# Altium schematic sheet Indicator_LEDs_RGB.SchDoc
size A4
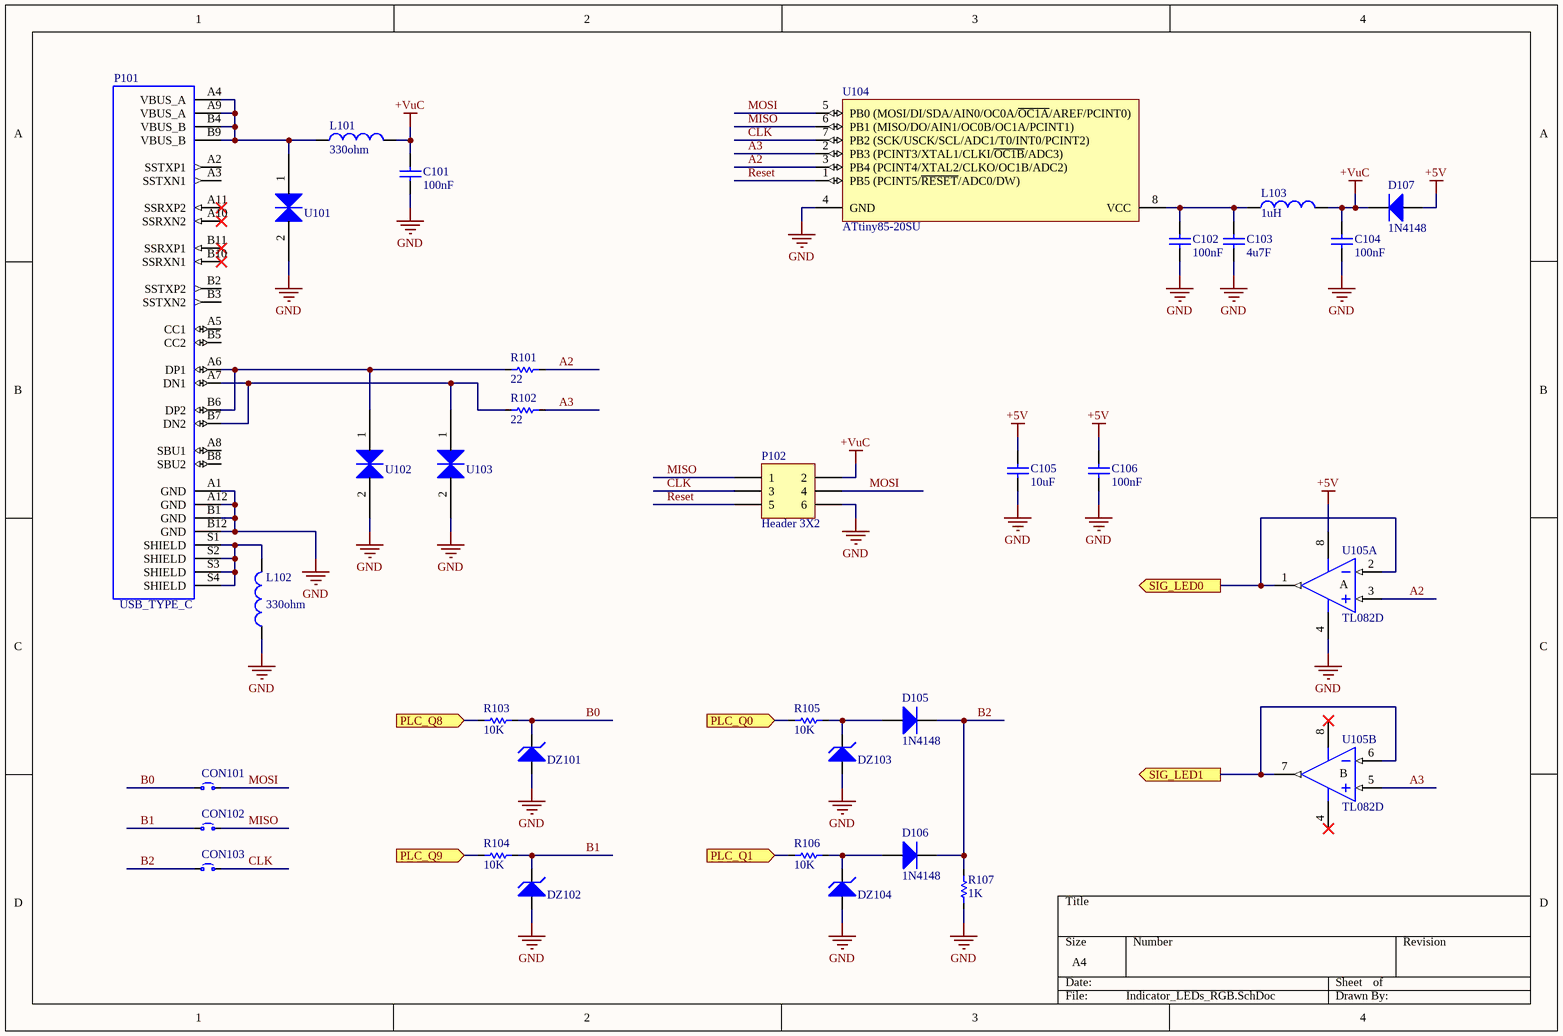
[diagram p0: Indicator_LEDs_RGB.SchDoc]

## Parts
C101  VALOR: 100nF  [C0603]  (hidden comment: Cap Ceramico SMD)
C102  VALOR: 100nF  [C0603]  (hidden comment: Cap Ceramico SMD)
C103  VALOR: 4u7F  [C0603]  (hidden comment: Cap Ceramico SMD)
C104  VALOR: 100nF  [C0603]  (hidden comment: Cap Ceramico SMD)
C105  VALOR: 10uF  [C0603]  (hidden comment: Cap Ceramico SMD)
C106  VALOR: 100nF  [C0603]  (hidden comment: Cap Ceramico SMD)
CON101  Puente  [PUENTE 0805]  (value not drawn)
CON102  Puente  [PUENTE 0805]  (value not drawn)
CON103  Puente  [PUENTE 0805]  (value not drawn)
D105  VALOR: 1N4148  [SOD-80]  (hidden comment: Diodo Rectificador SMD)
D106  VALOR: 1N4148  [SOD-80]  (hidden comment: Diodo Rectificador SMD)
D107  VALOR: 1N4148  [SOD-80]  (hidden comment: Diodo Rectificador SMD)
DZ101  Diodo Zenner SMD  [SOD-80]  (value not drawn)
DZ102  Diodo Zenner SMD  [SOD-80]  (value not drawn)
DZ103  Diodo Zenner SMD  [SOD-80]  (value not drawn)
DZ104  Diodo Zenner SMD  [SOD-80]  (value not drawn)
L101  value 330ohm  [J1-0603]  (hidden comment: Inductor)
L102  value 330ohm  [J1-0603]  (hidden comment: Inductor)
L103  value 1uH  [INDC1608L]  (hidden comment: Inductor)
P101  USB_TYPE_C  [USB_TYPE_C]
P102  Header 3X2  [HDR2X3]
R101  VALOR: 22  [R0603]  (hidden comment: Res SMD)
R102  VALOR: 22  [R0603]  (hidden comment: Res SMD)
R103  VALOR: 10K  [R0603]  (hidden comment: Res SMD)
R104  VALOR: 10K  [R0603]  (hidden comment: Res SMD)
R105  VALOR: 10K  [R0603]  (hidden comment: Res SMD)
R106  VALOR: 10K  [R0603]  (hidden comment: Res SMD)
R107  VALOR: 1K  [R0603]  (hidden comment: Res SMD)
U101  DIODE TVS BIDIR  [J1-0603]  (value not drawn)
U102  DIODE TVS BIDIR  [J1-0603]  (value not drawn)
U103  DIODE TVS BIDIR  [J1-0603]  (value not drawn)
U104  ATtiny85-20SU  [8S2_M]
U105  TL082D  [D008_L]  (parts A,B of 2)

## Ports
PLC_Q0 (in), PLC_Q1 (in), PLC_Q8 (in), PLC_Q9 (in), SIG_LED0 (out), SIG_LED1 (out)

## Nets
+5V: C105.1 C106.1 D107.1(A) U105.8(V+)
+VuC: C101.1 C104.1 D107.2(K) L101.2 L103.2 P102.2
GND: C101.2 C102.2 C103.1 C104.2 C105.2 C106.2 DZ101.1(A) DZ102.1(A) DZ103.1(A) DZ104.1(A) L102.1 P101.A1(GND) P101.A12(GND) P101.B1(GND) P101.B12(GND) P102.6 R107.2 U101.2 U102.2 U103.2 U104.4(GND) U105.4(V-)
A2: R101.1 U104.3(PB4_(PCINT4/XTAL2/CLKO/OC1B/ADC2)) U105.3(IN+)
A3: R102.1 U104.2(PB3_(PCINT3/XTAL1/CLKI/~{OC1B}/ADC3)) U105.5(IN+)
B0: CON101.1 DZ101.2(K) R103.2
B1: CON102.1 DZ102.2(K) R104.2
B2: CON103.1 D105.2(K) D106.2(K) R107.1
CLK: CON103.2 P102.3 U104.7(PB2_(SCK/USCK/SCL/ADC1/T0/INT0/PCINT2))
MISO: CON102.2 P102.1 U104.6(PB1_(MISO/DO/AIN1/OC0B/OC1A/PCINT1))
MOSI: CON101.2 P102.4 U104.5(PB0_(MOSI/DI/SDA/AIN0/OC0A/~{OC1A}/AREF/PCINT0))
PLC_Q0: R105.1 ; port PLC_Q0
PLC_Q1: R106.1 ; port PLC_Q1
PLC_Q8: R103.1 ; port PLC_Q8
PLC_Q9: R104.1 ; port PLC_Q9
Reset: P102.5 U104.1(PB5_(PCINT5/~{RESET}/ADC0/DW))
SIG_LED0: U105.1(OUT) U105.2(IN-) ; port SIG_LED0
SIG_LED1: U105.6(IN-) U105.7(OUT) ; port SIG_LED1
NetC102_1: C102.1 C103.2 L103.1 U104.8(VCC)
NetD105_1: D105.1(A) DZ103.2(K) R105.2
NetD106_1: D106.1(A) DZ104.2(K) R106.2
NetL101_1: L101.1 P101.A4(VBUS_A) P101.A9(VBUS_A) P101.B4(VBUS_B) P101.B9(VBUS_B) U101.1
NetL102_2: L102.2 P101.S1(SHIELD) P101.S2(SHIELD) P101.S3(SHIELD) P101.S4(SHIELD)
NetP101_A6: P101.A6(DP1) P101.B6(DP2) R101.2 U102.1
NetP101_A7: P101.A7(DN1) P101.B7(DN2) R102.2 U103.1

Not connected (* = marked no-connect by the designer): P101 A2(SSTXP1) A3(SSTXN1) A5(CC1) A8(SBU1) A10(SSRXN2)* A11(SSRXP2)* B2(SSTXP2) B3(SSTXN2) B5(CC2) B8(SBU2) B10(SSRXN1)* B11(SSRXP1)*

## Notes on the sheet
- (in symbol TL082D, part A) A
- (in symbol TL082D, part B) B

## Library data of the parts
C101-C106 = Cap Ceramico SMD: Cap Ceramico SMD 0805; CODIGO RUF: *; PROVEEDOR: *; FABRICANTE: *
  C101 C102 C104 C106: Arrow: C0603C104K5RACAUTO; Digikey: 399-6856-1-ND
  C103: Arrow: CL10A475KP8NNNC; Digikey: 1276-1044-1-ND
  C105: Arrow: CL10A106MQ8NNNC; Digikey: 1276-1119-1-ND
D105-D107 = Diodo Rectificador SMD: Diodo Rectificador; PROVEEDOR: *; CODIGO RUF: *; FABRIANTE: *; Arrow: FDLL4148; Digikey: FDLL4148TR-ND
DZ101 DZ102 DZ104 = Diodo Zenner SMD: VALOR: 5V1; PROVEEDOR: *; CODIGO RUF: *; FABRICANTE: *; Arrow: BZT55C5V1-GS08; Digikey: BZT55C5V1-GS08GICT-ND
DZ103 = Diodo Zenner SMD: VALOR: 5V6; PROVEEDOR: *; CODIGO RUF: *; FABRICANTE: *; Arrow: BZT55C5V6-GS08; Digikey: BZT55C5V6-GS08GICT-ND
L101-L103 = Inductor: Code_IEC: 1005; Published: 8-Jun-2000; LatestRevisionDate: 29-May-2009; LatestRevisionNote: IPC-7351 Footprint Added.; PackageReference: 0402-A; Publisher: Altium Limited; PackageDescription: Chip Inductor; Code_JEITA: 0402
  L101 L102: DigiKey: 445-5221-1-ND; Arrow: MPZ1608S331ATA00
  L103: Arrow: ASMPH-0603-1R0M-T; Digikey: 535-12263-1-ND
P101 = USB Type C: USB - C _Type - C_ USB 3.1 _USB 3.1 Gen 2, Superspeed+_ Receptacle Connector 24 Position Surface Mount, Right Angle; Through Hole; MF: Amphenol ICC; MP: 10137062-00021LF; Package: None; Price: None; Availability: Unavailable; SnapEDA_Link: https://www.snapeda.com/parts/10137062-00021LF/Amphenol%20ICC/view-part/2697942/?ref=snap; Value: *; Arrow: 10137062-00021LF; Digikey: 609-6109-1-ND
P102 = Header 3X2: Header, 3-Pin, Dual row; LatestRevisionDate: 17-Jul-2002; LatestRevisionNote: Re-released for DXP Platform.; Publisher: Altium Limited; Arrow: *; Digikey: *
U101-U103 = DIODE TVS BIDIRECTIONAL: DigiKey: 283-2791-1-ND; Arrow: 0603ESDA-MLP7
U104 = ATtiny85-20SU: Low Power tinyAVR® 8-Bit Microcontroller, 8K Flash Memory, 20MHz, Industrial Temperature, 8-Lead SOIC, Pb-Free; Published: 20-Nov-2009; DatasheetVersion: DOC2586I, May-2008; PackageVersion: revF, Apr-2008; PackageReference: 8S2; Publisher: Altium Limited; PackageDescription: 8-Lead, 0.208" Body, Plastic Small Outline Package (EIAJ); Supplier 1: Digi-Key; Supplier Part Number 1: ATTINY85-20SU-ND; Supplier 2: Farnell; Supplier Part Number 2: 1455164; Supplier 3: Mouser; Supplier Part Number 3: 556-ATTINY85-20SU; ComponentLink1Description: Manufacturer Link; ComponentLink1URL: http://www.atmel.com/products/AVR/tinyavr.asp?; ComponentLink2Description: Datasheet; ComponentLink2URL: http://www.atmel.com/dyn/resources/prod_documents/doc2586.pdf; ComponentLink3Description: Atmel.com Home; ComponentLink3URL: http://www.atmel.com; Arrow: ATTINY85-20SU; Digikey: ATTINY85-20SU-ND
U105 = TL082D: JFET-Input Operational Amplifier; Published: 16-Jan-2001; LatestRevisionDate: 13-Apr-2006; LatestRevisionNote: IPC-7351 Footprint Added.; DatasheetVersion: Feb-1999; PackageVersion: Jan-1998; PackageReference: D008; Publisher: Altium Limited; PackageDescription: 8-Pin Small Outline Integrated Circuit 1.27 mm Pitch; Code_IPC: SOIC127P600-8; ComponentLink1Description: Manufacturer Link; ComponentLink1URL: http://www.ti.com/; ComponentLink2Description: Datasheet; ComponentLink2URL: http://www-s.ti.com/sc/ds/tl082.pdf; Arrow: TL082IDR; Digikey: 296-15005-1-ND
CON101-CON103 = Puente: Digikey: RMCF0805ZT0R00CT-ND; Arrow: RMCF0805ZT0R00
R101-R107 = Res SMD: CODIGO RUF: *; PROVEEDOR: *; FABRICANTE: *
  R101 R102: Arrow: CRCW060322R0FKEAC; Digikey: 541-4025-1-ND
  R103-R106: Arrow: MCT06030C1002FP500; Digikey: RMCF0603FT10K0CT-ND
  R107: Arrow: RCA06031K00FKEA; Digikey: YAG2323CT-ND